# Altium schematic sheet Cool.SchDoc
size A4
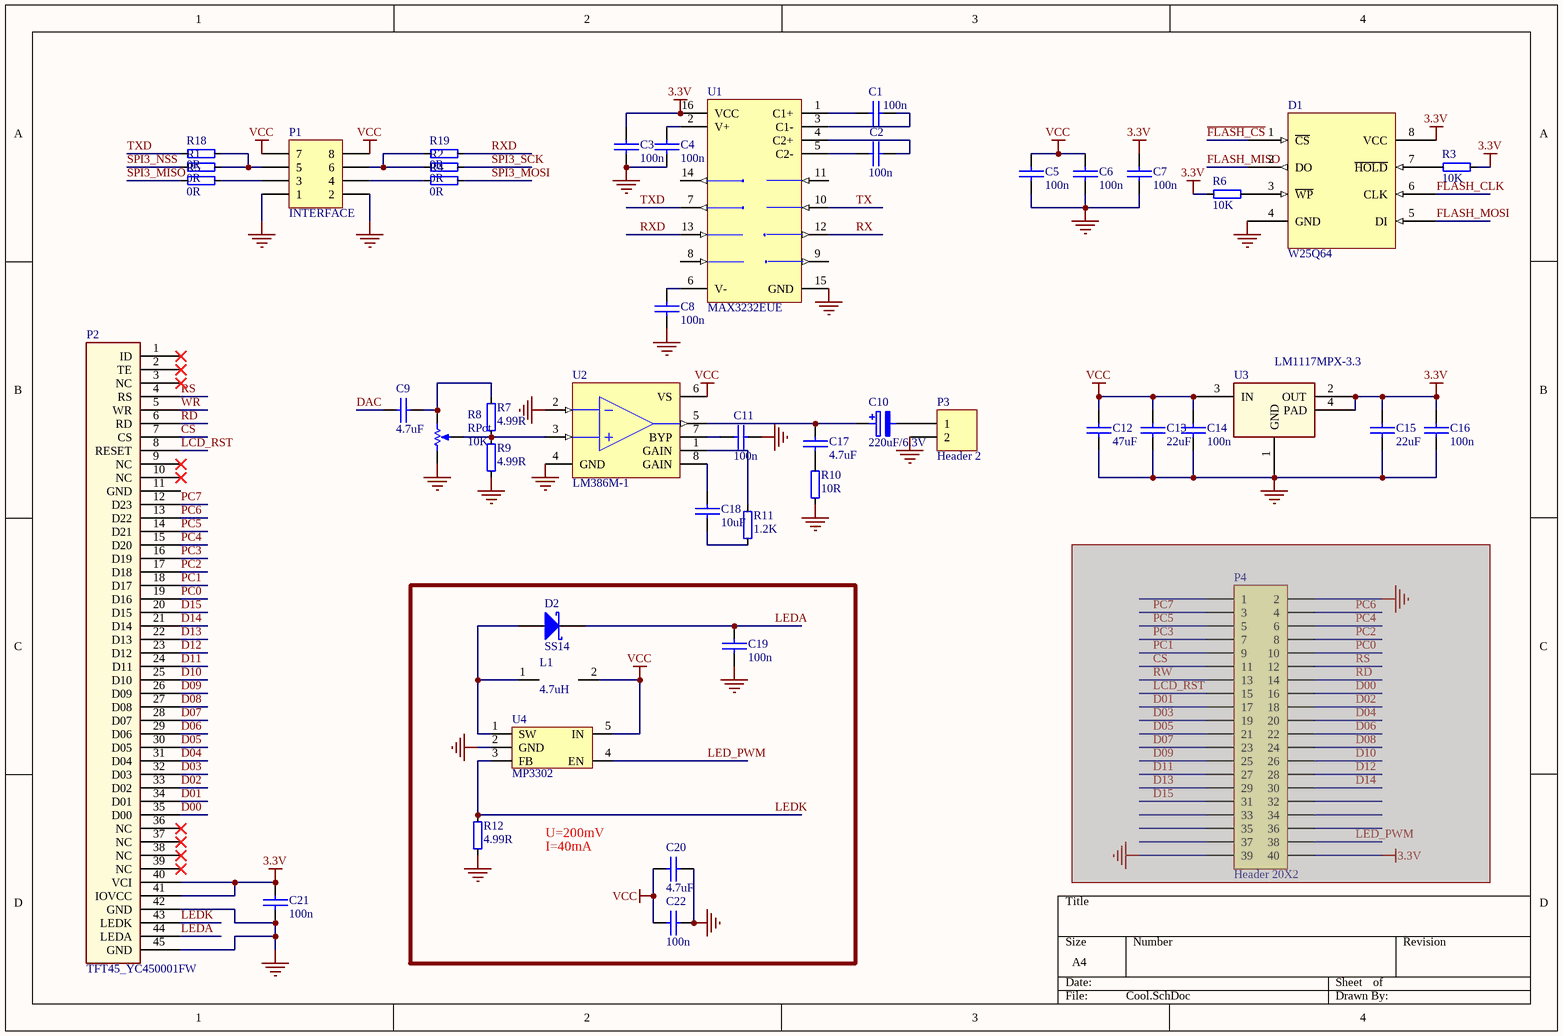
[diagram p0: Cool.SchDoc]

## Parts
C1  100n  [0603]
C2  100n  [0603]
C3  100n  [0603]
C4  100n  [0603]
C5  100n  [0603]
C6  100n  [0603]
C7  100n  [0603]
C8  100n  [0603]
C9  4.7uF  [0603]
C10  220uF/6.3V  [6032]
C11  100n  [0603]
C12  47uF  [1206]
C13  22uF  [1206]
C14  100n  [0603]
C15  22uF  [1206]
C16  100n  [0603]
C17  4.7uF  [0603]
C18  10uF  [0603]
C19  100n  [0603]
C20  4.7uF  [0603]
C21  100n  [0603]
C22  100n  [0603]
D1  W25Q64  [SOIC127P790X200-8N]
D2  SS14  [SOD123]
L1  4.7uH  [SMD4532]
P1  INTERFACE  [P_Head_2x4]
P2  TFT45_YC450001FW  [FPC45]
P3  Header 2  [P_Head_2]
P4  Header 20X2  [P_Head_2x20]  (masked out: inside a compile mask, not in the netlist)
R1  0R  [0603]
R2  0R  [0603]
R3  10K  [0603]
R4  0R  [0603]
R5  0R  [0603]
R6  10K  [0603]
R7  4.99R  [0603]
R8  RPot  value 10K  [VR5]
R9  4.99R  [0603]
R10  10R  [0603]
R11  1.2K  [0603]
R12  4.99R  [0603]
R18  0R  [0603]
R19  0R  [0603]
U1  MAX3232EUE  [TSSOP16]
U2  LM386M-1  [M08A_N]
U3  LM1117MPX-3.3  [SOT223]
U4  MP3302  [sot23-5]

## Nets
3.3V: C3.2 C7.1 C15.1 C16.1 C21.2 D1.8(VCC) P2.40(VCI) P2.41(IOVCC) R3.2 R6.1 U1.16(VCC) U3.2(OUT) U3.4(PAD)
GND: C3.1 C4.1 C5.2 C6.2 C7.2 C8.1 C11.2 C12.2 C13.2 C14.2 C15.2 C16.2 C19.1 C20.2 C21.1 C22.2 D1.4(GND) P1.1 P1.2 P2.42(GND) P2.45(GND) P3.2 R8.1(TOP) R9.1 R10.1 R12.1 U1.15(GND) U2.2(IN-) U2.4(GND) U3.1(GND) U4.2(GND)
VCC: C5.1 C6.1 C12.1 C13.1 C14.1 C20.1 C22.1 L1.2 P1.7 P1.8 U2.6(VS) U3.3(IN) U4.5(IN)
CS: P2.7(CS)
D00: P2.35(D00)
D01: P2.34(D01)
D02: P2.33(D02)
D03: P2.32(D03)
D04: P2.31(D04)
D05: P2.30(D05)
D06: P2.29(D06)
D07: P2.28(D07)
D08: P2.27(D08)
D09: P2.26(D09)
D10: P2.25(D10)
D11: P2.24(D11)
D12: P2.23(D12)
D13: P2.22(D13)
D14: P2.21(D14)
D15: P2.20(D15)
DAC: C9.2
~{FLASH_CS}: D1.1(~{CS})
FLASH_CLK: D1.6(CLK)
FLASH_MISO: D1.2(DO)
FLASH_MOSI: D1.5(DI)
LCD_RST: P2.8(RESET)
LED_PWM: U4.4(EN)
LEDA: C19.2 D2.2(K) P2.44(LEDA)
LEDK: P2.43(LEDK) R12.2 U4.3(FB)
PC0: P2.19(D16)
PC1: P2.18(D17)
PC2: P2.17(D18)
PC3: P2.16(D19)
PC4: P2.15(D20)
PC5: P2.14(D21)
PC6: P2.13(D22)
PC7: P2.12(D23)
RD: P2.6(RD)
RS: P2.4(RS)
RX: U1.12(R1OUT)
RXD: R19.2 U1.13(R1IN)
SPI3_MISO: R5.1
SPI3_MOSI: R4.2
SPI3_NSS: R1.1
SPI3_SCK: R2.2
TX: U1.10(T2IN)
TXD: R18.1 U1.7(T2OUT)
WR: P2.5(WR)
NetC1_1: C1.1 U1.1(C1+)
NetC1_2: C1.2 U1.3(C1-)
NetC2_1: C2.1 U1.5(C2-)
NetC2_2: C2.2 U1.4(C2+)
NetC4_2: C4.2 U1.2(V+)
NetC8_2: C8.2 U1.6(V-)
NetC9_1: C9.1 R7.2 R8.2(BOT)
NetC10_1: C10.1 C17.1 U2.5(OUT)
NetC10_2: C10.2 P3.1
NetC11_1: C11.1 U2.7(BYP)
NetC17_2: C17.2 R10.2
NetC18_1: C18.1 U2.8(GAIN)
NetC18_2: C18.2 R11.1
NetD1_3: D1.3(~{WP}) R6.2
NetD1_7: D1.7(~{HOLD}) R3.1
NetD2_1: D2.1(A) L1.1 U4.1(SW)
NetP1_3: P1.3 R5.2
NetP1_4: P1.4 R4.1
NetP1_5: P1.5 R1.2 R18.2
NetP1_6: P1.6 R2.1 R19.1
NetR7_1: R7.1 R8.3(TAP) R9.2 U2.3(IN+)
NetR11_2: R11.2 U2.1(GAIN)

Not connected (* = marked no-connect by the designer): P2 1(ID)* 2(TE)* 3(NC)* 9(NC)* 10(NC)* 11(GND) 36(NC)* 37(NC)* 38(NC)* 39(NC)*; U1 8(R2IN) 9(R2OUT) 11(T1IN) 14(T1OUT)

## Notes on the sheet
- U=200mV
- I=40mA

## Library data of the parts
C1-C9 C11-C22 = CAP: 贴片瓷片电容
C10 = ELECTRO: 贴片电解电容; Value: 220uF/6.3V
D2 = D Schottky: Schottky Diode; Published: 8-Jun-2000; LatestRevisionDate: 17-Jul-2002; LatestRevisionNote: Re-released for DXP Platform.; PackageReference: SMB; Publisher: Altium Limited; PackageDescription: DO-214-AA/SMB; 2 C-Bend Leads; Body 5.3 x 3.6 mm, inc. leads (LxW); Code_JEDEC: DO-214-AA
L1 = Inductor
P1 = Header 4X2: Header, 4-Pin, Dual row; LatestRevisionDate: 17-Jul-2002; LatestRevisionNote: Re-released for DXP Platform.; Publisher: Altium Limited
P3 = Header 2: Header, 2-Pin; LatestRevisionDate: 17-Jul-2002; LatestRevisionNote: Re-released for DXP Platform.; Publisher: Altium Limited
P4 = Header 20X2: Header, 20-Pin, Dual row; LatestRevisionDate: 17-Jul-2002; LatestRevisionNote: Re-released for DXP Platform.; Publisher: Altium Limited
R1-R7 R9-R12 R18 R19 = RES: 贴片电阻（5%）
R8 = RPot: Potentiometer; Sim Note: Enter the Resistance value and the set point into parameter fields.; Set Position: 0.5; Published: 8-Jun-2000; LatestRevisionDate: 17-Jul-2002; LatestRevisionNote: Re-released for DXP Platform.; PackageReference: VR5; Publisher: Altium Limited
U1 = MAX3232EUE: 3.0V TO 5.5V, Low-Power, up to 1Mbps, True RS-232 Transceiver Using Four 0.1µF External Capacitor; Published: 16-Jan-2001; LatestRevisionDate: 06-Jun-2005; LatestRevisionNote: Stylized 3D Model Added.; DatasheetVersion: Mar-1999; PackageVersion: 21-0066 C; PackageReference: TSSOP16; Publisher: Altium Limited; PackageDescription: Shrink Small Outline; 16 Leads; Body Width 4.4 mm; Pitch 0.65 mm; ComponentLink1Description: Manufacturer Link; ComponentLink1URL: http://www.maxim-ic.com/; ComponentLink2Description: Datasheet; ComponentLink2URL: http://pdfserv.maxim-ic.com/en/ds/MAX3222-MAX3241.pdf
U2 = LM386M-1: Low-Voltage Audio Power Amplifier; Published: 15-Apr-2002; LatestRevisionDate: 13-Apr-2006; LatestRevisionNote: IPC-7351 Footprint Added.; DatasheetVersion: Sep-1997; PackageVersion: Sep-1997; PackageReference: M08A; Publisher: Altium Limited; PackageDescription: 8-Pin Small Outline Integrated Circuit 1.27 mm Pitch; Code_JEDEC: MS-012-AA; Code_IPC: SOIC127P600-8; ComponentLink1Description: Manufacturer Link; ComponentLink1URL: http://www.national.com/; ComponentLink2Description: Datasheet; ComponentLink2URL: http://www.national.com/ds.cgi/LM/LM386.pdf; ComponentLink3Description: URL Link1; ComponentLink3URL: http://www.national.com/pf/LM/LM386.html
U3 = LM1117: 电源LDO